# Altium project SparkyTime Project.PrjPcb
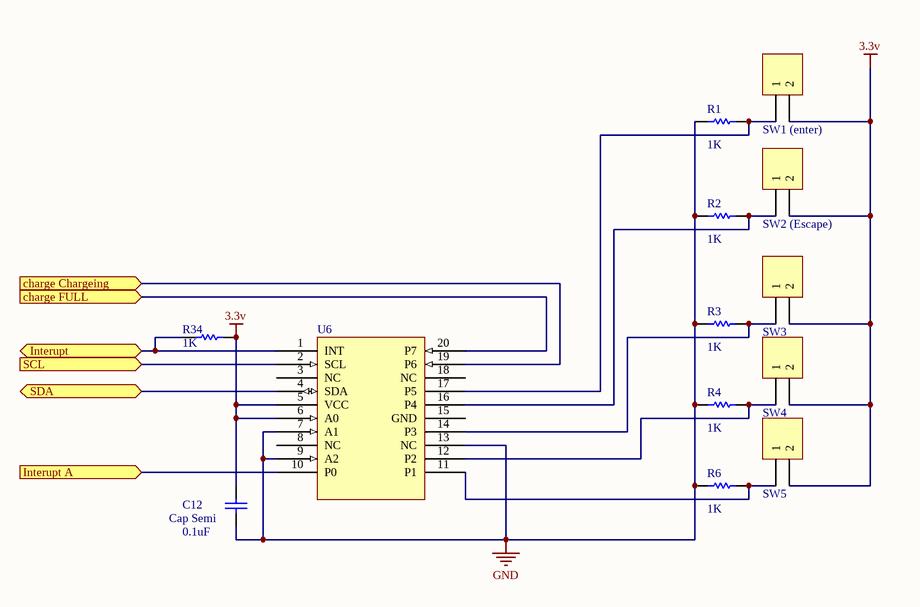
[diagram p0: Buttonz.SchDoc]
8 sheets, 94 parts. Net scope: flat (ports and power ports of the same name join across sheets).
Board files: SPARKy watch PCB MK1.PcbDoc, SPARKy watch PCB blank.PcbDoc, SPARKy watch PCB blank - David.PcbDoc
Sheets:
  Buttonz.SchDoc
  Serial devises.SchDoc
  Battery Sensor.SchDoc
  Screens.SchDoc
  MCU.SchDoc
  RTC.SchDoc
  Prefreals.SchDoc
  V stuff.SchDoc

## Sheet Buttonz.SchDoc
size A4

### Parts
C12  Cap Semi  value 0.1uF  [C1206]
P40  SW1 (enter)  [HDR1X2]
P41  SW2 (Escape)  [HDR1X2]
P42  SW3  [HDR1X2]
P43  SW4  [HDR1X2]
P44  SW5  [HDR1X2]
R1  value 1K  [0402]  (hidden comment: Res1)
R2  value 1K  [0402]  (hidden comment: Res1)
R3  value 1K  [0402]  (hidden comment: Res1)
R4  value 1K  [0402]  (hidden comment: Res1)
R6  value 1K  [0402]  (hidden comment: Res1)
R34  value 1K  [0402]  (hidden comment: Res1)
U6  Component_1  [SOP20]  (value not drawn)

### Ports
charge Chargeing (in), charge FULL (in), Interupt (bidir), Interupt A (in), SCL (in), SDA (bidir)

### Nets
3.3v: C12.2 P40.2 P41.2 P42.2 P43.2 P44.2 R34.2 U6.5(VCC) U6.6(A0)
GND: C12.1 R1.1 R2.1 R3.1 R4.1 R6.1 U6.7(A1) U6.9(A2) U6.13(NC)
NetP40_1: P40.1 R1.2 U6.17(P5)
NetP41_1: P41.1 R2.2 U6.16(P4)
NetP42_1: P42.1 R3.2 U6.14(P3)
NetP43_1: P43.1 R4.2 U6.12(P2)
NetP44_1: P44.1 R6.2 U6.11(P1)
NetR21_2: U6.20(P7) ; port charge FULL
NetR26_2: U6.19(P6) ; port charge Chargeing
NetR34_1: R34.1 U6.1(INT) ; port Interupt
NetU1_27: U6.4(SDA) ; port SDA
NetU1_28: U6.2(SCL) ; port SCL
NetU2_12: U6.10(P0) ; port Interupt A

Not connected (* = marked no-connect by the designer): U6 3(NC) 8(NC) 15(GND) 18(NC)

### Library data of the parts
C12 = Cap Semi: Capacitor (Semiconductor SIM Model); Published: 8-Jun-2000; LatestRevisionDate: 29-May-2009; LatestRevisionNote: IPC-7351 Footprint Added.; PackageReference: C1206; Publisher: Altium Limited; PackageDescription: Chip Capacitor
P40-P44 = Header 2: Header, 2-Pin; LatestRevisionDate: 17-Jul-2002; LatestRevisionNote: Re-released for DXP Platform.; Publisher: Altium Limited
R1-R4 R6 R34 = Res1: Resistor; Published: 8-Jun-2000; LatestRevisionDate: 17-Jul-2002; LatestRevisionNote: Re-released for DXP Platform.; PackageReference: AXIAL-0.3; Publisher: Altium Limited; PackageDescription: Axial Device, Thru-Hole; 2 Leads; 0.3 in Pin Spacing

## Sheet Serial devises.SchDoc
size A4
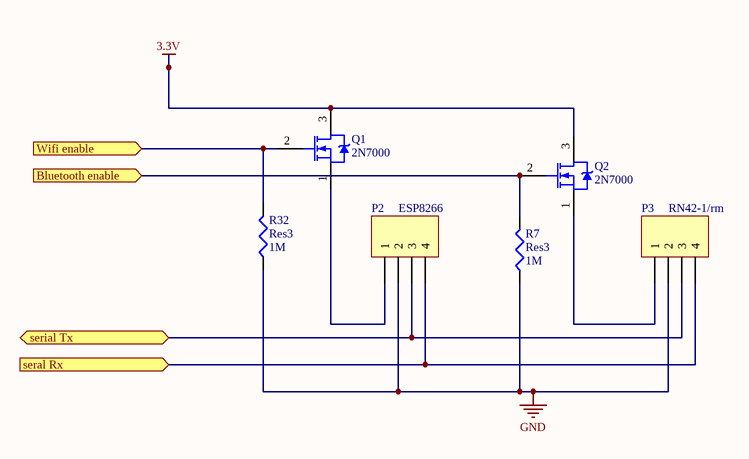
[diagram p1: Serial devises.SchDoc]

### Parts
P2  ESP8266  [HDR1X4]
P3  RN42-1/rm  [HDR1X4]
Q1  2N7000  [ONSC-SOT-323-3-419-04_V]
Q2  2N7000  [ONSC-SOT-323-3-419-04_V]
R7  Res3  value 1M  [0402]
R32  Res3  value 1M  [0402]

### Ports
Bluetooth enable (in), seral Rx (in), serial Tx (bidir), Wifi enable (in)

### Nets
3.3v: Q1.3(D) Q2.3(D)
GND: P2.2 P3.2 R7.1 R32.1
NetP1_2: P2.3 P3.3 ; port serial Tx
NetP1_3: P2.4 P3.4 ; port seral Rx
NetP2_1: P2.1 Q1.1(S)
NetP3_1: P3.1 Q2.1(S)
NetQ1_2: Q1.2(G) R32.2 ; port Wifi enable
NetQ2_2: Q2.2(G) R7.2 ; port Bluetooth enable

### Library data of the parts
P2 P3 = Header 4: Header, 4-Pin; LatestRevisionDate: 17-Jul-2002; LatestRevisionNote: Re-released for DXP Platform.; Publisher: Altium Limited
Q1 Q2 = 2N7000: Small Signal MOSFET, 200 mA, 60 V, N-Channel, 3-Pin TO-92, Bulk Box; Manufacturer: On Semiconductor; Channel Polarity: N Channel; Ciss Typ (pF): 60; Configuration: Single; Coss Typ (pF): 25; Crss Typ (pF): 5; ID Max (A): 0.2; PD Max (W): 0.35; VGS Max (V): 20; VGS(th) Max (V): 3; DatasheetVersion: Rev. 8; PackageVersion: Rev. AM; PackageReference: TO-92-3-29-11_AM_SL; PackageDescription: 3-Pin Transistor Outline, Body 4.825 x 3.685 mm, Pitch 1.27 mm; Package Type: TO-92; Packing: Bulk Box; V(BR)DSS Min (V): 60; Mounting Technology: Through Hole; PartNumber: 2N7000; ComponentLink1Description: Manufacturer URL; ComponentLink1URL: http://www.onsemi.com/; ComponentLink2Description: Datasheet; ComponentLink2URL: http://www.onsemi.com/pub_link/Collateral/2N7000-D.PDF; ComponentLink3Description: Package Specification; ComponentLink3URL: http://www.onsemi.cn/pub_link/Collateral/2N6426-D.PDF
R7 R32 = Res3: Resistor; Published: 8-Jun-2000; LatestRevisionDate: 29-May-2009; LatestRevisionNote: IPC-7351 Footprint Added.; PackageReference: J1-0603; Publisher: Altium Limited; PackageDescription: Chip Resistor

## Sheet Battery Sensor.SchDoc
size A4
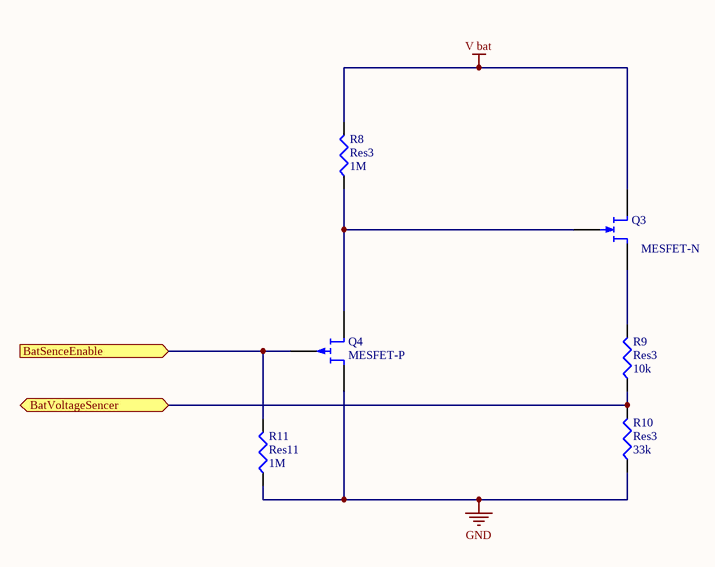
[diagram p2: Battery Sensor.SchDoc]

### Parts
Q3  MESFET-N  [ONSC-SOT-323-3-419-04_V]
Q4  MESFET-P  [ONSC-SOT-323-3-419-04_V]
R8  Res3  value 1M  [0402]
R9  Res3  value 10k  [0402]
R10  Res3  value 33k  [0402]
R11  Res11  value 1M  [0402]

### Ports
BatSenceEnable (in), BatVoltageSencer (bidir)

### Nets
GND: Q4.1(D) R10.1 R11.1
V bat: Q3.1(D) R8.2
NetQ3_2: Q3.2(G) Q4.3(S) R8.1
NetQ3_3: Q3.3(S) R9.2
NetQ4_2: Q4.2(G) R11.2 ; port BatSenceEnable
NetR9_1: R9.1 R10.2 ; port BatVoltageSencer

### Library data of the parts
Q3 = MESFET-N: N-Channel MESFET; Published: 8-Jun-2000; LatestRevisionDate: 17-Jul-2002; LatestRevisionNote: Re-released for DXP Platform.; PackageReference: TO-18; Publisher: Altium Limited; PackageDescription: Can; 3 Leads; Pin Circle Dia. 2.54 mm; Lead Dia. 0.48 mm (max); Code_JEDEC: TO-18
Q4 = MESFET-P: P-Channel MESFET; Published: 8-Jun-2000; LatestRevisionDate: 17-Jul-2002; LatestRevisionNote: Re-released for DXP Platform.; PackageReference: TO-18; Publisher: Altium Limited; PackageDescription: Can; 3 Leads; Pin Circle Dia. 2.54 mm; Lead Dia. 0.48 mm (max); Code_JEDEC: TO-18
R8-R11 = Res3: Resistor; Published: 8-Jun-2000; LatestRevisionDate: 29-May-2009; LatestRevisionNote: IPC-7351 Footprint Added.; PackageReference: J1-0603; Publisher: Altium Limited; PackageDescription: Chip Resistor

## Sheet Screens.SchDoc
size A4
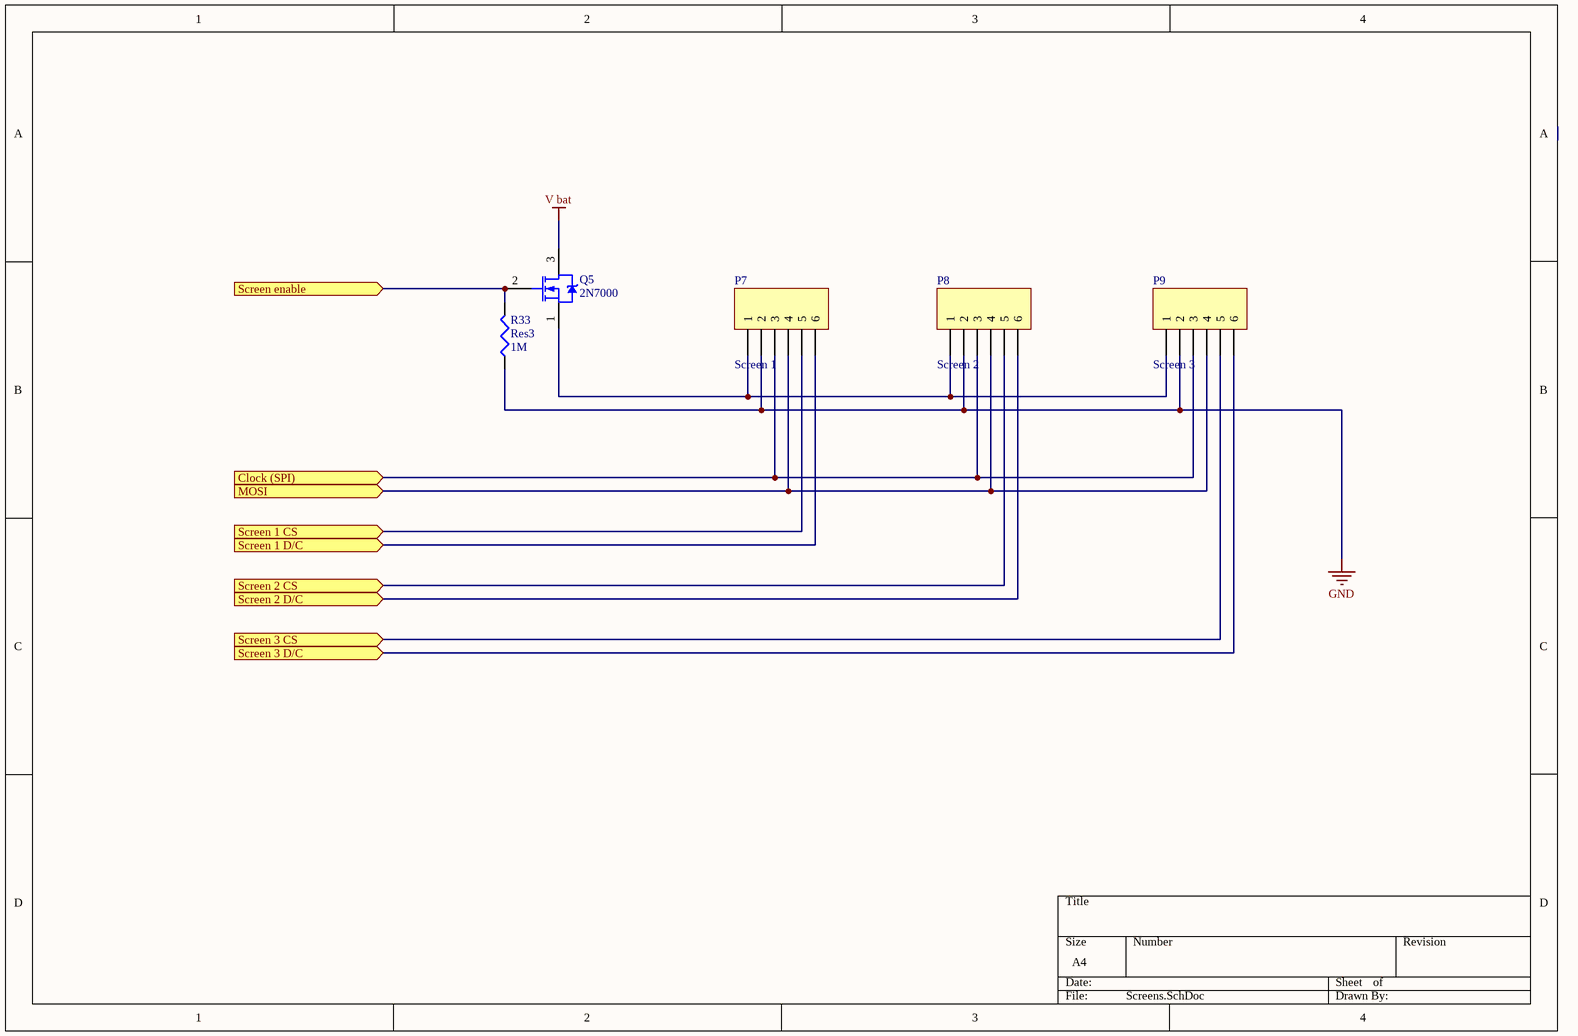
[diagram p3: Screens.SchDoc]

### Parts
P7  Screen 1  [HDR1X6]
P8  Screen 2  [HDR1X6]
P9  Screen 3  [HDR1X6]
Q5  2N7000  [ONSC-SOT-323-3-419-04_V]
R33  Res3  value 1M  [0402]

### Ports
Clock (SPI) (in), MOSI (in), Screen 1 CS (in), Screen 1 D/C (in), Screen 2 CS (in), Screen 2 D/C (in), Screen 3 CS (in), Screen 3 D/C (in), Screen enable (in)

### Nets
GND: P7.2 P8.2 P9.2 R33.1
V bat: Q5.3(D)
NetP7_1: P7.1 P8.1 P9.1 Q5.1(S)
NetP7_3: P7.3 P8.3 P9.3 ; port Clock (SPI)
NetP7_4: P7.4 P8.4 P9.4 ; port MOSI
NetP7_5: P7.5 ; port Screen 1 CS
NetP7_6: P7.6 ; port Screen 1 D/C
NetP8_5: P8.5 ; port Screen 2 CS
NetP8_6: P8.6 ; port Screen 2 D/C
NetP9_5: P9.5 ; port Screen 3 CS
NetP9_6: P9.6 ; port Screen 3 D/C
NetQ5_2: Q5.2(G) R33.2 ; port Screen enable

### Library data of the parts
P7-P9 = Header 6: Header, 6-Pin; LatestRevisionDate: 17-Jul-2002; LatestRevisionNote: Re-released for DXP Platform.; Publisher: Altium Limited
Q5 = 2N7000: as Q1 on sheet Serial devises; DatasheetVersion: Rev. 8; PackageVersion: Rev. AM; PackageReference: TO-92-3-29-11_AM_SL; PackageDescription: 3-Pin Transistor Outline, Body 4.825 x 3.685 mm, Pitch 1.27 mm; Package Type: TO-92; Packing: Bulk Box; V(BR)DSS Min (V): 60; Mounting Technology: Through Hole; PartNumber: 2N7000; ComponentLink1Description: Manufacturer URL; ComponentLink1URL: http://www.onsemi.com/; ComponentLink2Description: Datasheet; ComponentLink2URL: http://www.onsemi.com/pub_link/Collateral/2N7000-D.PDF; ComponentLink3Description: Package Specification; ComponentLink3URL: http://www.onsemi.cn/pub_link/Collateral/2N6426-D.PDF
R33 = Res3: Resistor; Published: 8-Jun-2000; LatestRevisionDate: 29-May-2009; LatestRevisionNote: IPC-7351 Footprint Added.; PackageReference: J1-0603; Publisher: Altium Limited; PackageDescription: Chip Resistor

## Sheet MCU.SchDoc
size A4
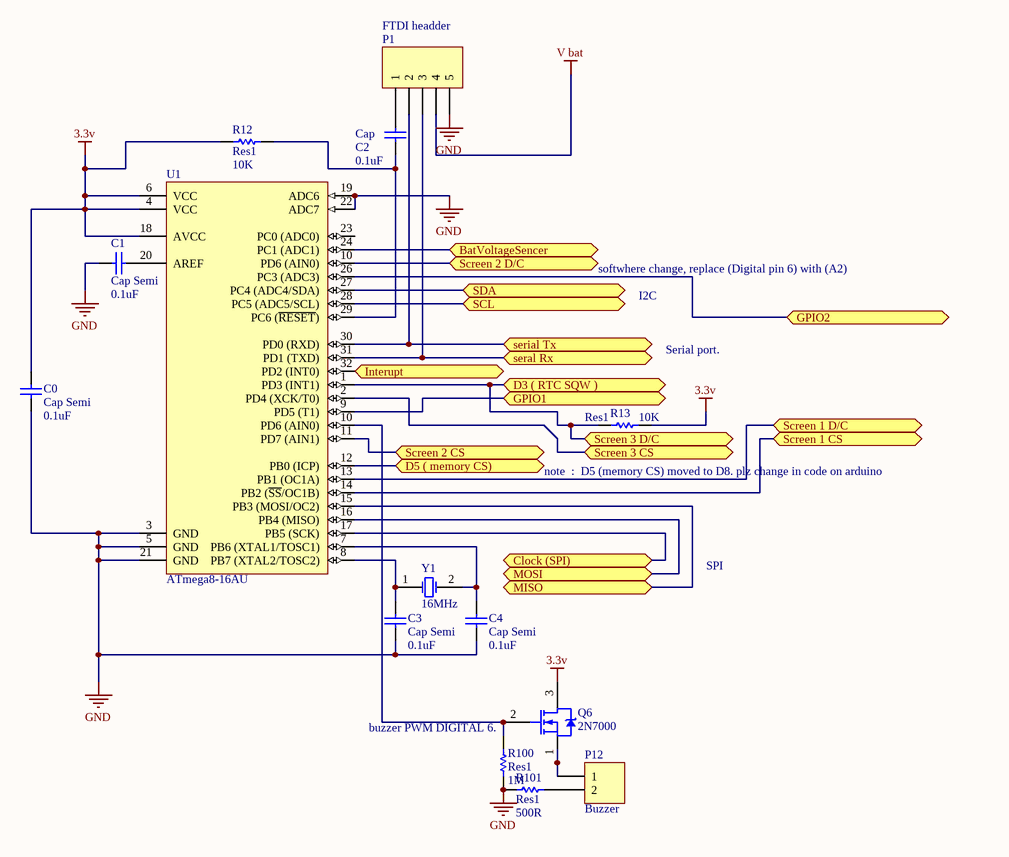
[diagram p4: MCU.SchDoc]

### Parts
(Parts that share a designator on the sheet are numbered #1, #2 ... from top to bottom, then left to right.)
C0  Cap Semi  value 0.1uF  [C1206]
C1  Cap Semi  value 0.1uF  [C1206]
C2  Cap  value 0.1uF  [J1-0603]
C3  Cap Semi  value 0.1uF  [C1206]
C4  Cap Semi  value 0.1uF  [C1206]
P1  FTDI headder  [HDR1X5]
P12#1  Buzzer  [HDR1X2]
Q6#1  2N7000  [ONSC-SOT-323-3-419-04_V]
R12  Res1  value 10K  [0402]
R13  Res1  value 10K  [0402]
R100  Res1  value 1M  [0603]
R101  Res1  value 500R  [0603]
U1  ATmega8-16AU  [32A_N]
Y1  16MHz  [R38]

### Ports
BatVoltageSencer (bidir), Clock (SPI) (bidir), D3 ( RTC SQW ) (bidir), D5 ( memory CS) (bidir), GPIO1 (bidir), GPIO2 (bidir), Interupt (bidir), MISO (bidir), MOSI (bidir), SCL (bidir), Screen 1 CS (bidir), Screen 1 D/C (bidir), Screen 2 CS (bidir), Screen 2 D/C (bidir), Screen 3 CS (bidir), Screen 3 D/C (bidir), SDA (bidir), seral Rx (bidir), serial Tx (bidir)

### Nets
3.3v: C0.2 Q6#1.3(D) R12.1 R13.2 U1.4(VCC) U1.6(VCC) U1.18(AVCC)
GND: C0.1 C1.1 C3.1 C4.1 P1.5 R100.2 R101.1 U1.3(GND) U1.5(GND) U1.19(ADC6) U1.21(GND) U1.22(ADC7)
V bat: P1.4
NetC1_2: C1.2 U1.20(AREF)
NetC2_1: C2.1 P1.1
NetC2_2: C2.2 R12.2 U1.29(PC6_(~{RESET}))
NetC3_2: C3.2 U1.8(PB7_(XTAL2/TOSC2)) Y1.1(OSC1)
NetC4_2: C4.2 U1.7(PB6_(XTAL1/TOSC1)) Y1.2(OSC2)
NetD2_1: U1.9(PD5_(T1)) ; port GPIO1
NetD4_1: U1.26(PC3_(ADC3)) ; port GPIO2
NetP1_2: P1.2 U1.30(PD0_(RXD)) ; port serial Tx
NetP1_3: P1.3 U1.31(PD1_(TXD)) ; port seral Rx
NetP7_3: U1.17(PB5_(SCK)) ; port Clock (SPI)
NetP7_4: U1.16(PB4_(MISO)) ; port MOSI
NetP7_5: U1.14(PB2_(~{SS}/OC1B)) ; port Screen 1 CS
NetP7_6: U1.13(PB1_(OC1A)) ; port Screen 1 D/C
NetP8_5: U1.11(PD7_(AIN1)) ; port Screen 2 CS
NetP8_6: U1.10(PD6_(AIN0)) ; port Screen 2 D/C
NetP9_5: U1.2(PD4_(XCK/T0)) ; port Screen 3 CS
NetP9_6: R13.1 U1.1(PD3_(INT1)) ; port Screen 3 D/C, port D3 ( RTC SQW )
NetP12#1_1: P12#1.1 Q6#1.1(S)
NetP12#1_2: P12#1.2 R101.2
NetQ6#1_2: Q6#1.2(G) R100.1 U1.10(PD6_(AIN0))
NetR9_1: U1.24(PC1_(ADC1)) ; port BatVoltageSencer
NetR34_1: U1.32(PD2_(INT0)) ; port Interupt
NetU1_12: U1.12(PB0_(ICP)) ; port D5 ( memory CS)
NetU1_15: U1.15(PB3_(MOSI/OC2)) ; port MISO
NetU1_27: U1.27(PC4_(ADC4/SDA)) ; port SDA
NetU1_28: U1.28(PC5_(ADC5/SCL)) ; port SCL

Not connected (* = marked no-connect by the designer): U1 23(PC0_(ADC0))

### Notes on the sheet
- softwhere change, replace (Digital pin 6) with (A2)
- I2C
- Serial port.
- (near R13) note  :  D5 (memory CS) moved to D8. plz change in code on arduino
- SPI
- (near R100) buzzer PWM DIGITAL 6.

### Library data of the parts
C0 C1 C3 C4 = Cap Semi: Capacitor (Semiconductor SIM Model); Published: 8-Jun-2000; LatestRevisionDate: 29-May-2009; LatestRevisionNote: IPC-7351 Footprint Added.; PackageReference: C1206; Publisher: Altium Limited; PackageDescription: Chip Capacitor
C2 = Cap: Capacitor; Published: 8-Jun-2000; LatestRevisionDate: 17-Jul-2002; LatestRevisionNote: Re-released for DXP Platform.; PackageReference: RAD-0.3; Publisher: Altium Limited; PackageDescription: Radial Cap, Thru-Hole; 2 Leads; 0.3 in Pin Spacing
P1 = Header 5: Header, 5-Pin; LatestRevisionDate: 17-Jul-2002; LatestRevisionNote: Re-released for DXP Platform.; Publisher: Altium Limited
P12#1 = Header 2: Header, 2-Pin; LatestRevisionDate: 17-Jul-2002; LatestRevisionNote: Re-released for DXP Platform.; Publisher: Altium Limited
Q6#1 = 2N7000: as Q1 on sheet Serial devises; DatasheetVersion: Rev. 8; PackageVersion: Rev. AM; PackageReference: TO-92-3-29-11_AM_SL; PackageDescription: 3-Pin Transistor Outline, Body 4.825 x 3.685 mm, Pitch 1.27 mm; Package Type: TO-92; Packing: Bulk Box; V(BR)DSS Min (V): 60; Mounting Technology: Through Hole; PartNumber: 2N7000; ComponentLink1Description: Manufacturer URL; ComponentLink1URL: http://www.onsemi.com/; ComponentLink2Description: Datasheet; ComponentLink2URL: http://www.onsemi.com/pub_link/Collateral/2N7000-D.PDF; ComponentLink3Description: Package Specification; ComponentLink3URL: http://www.onsemi.cn/pub_link/Collateral/2N6426-D.PDF
R12 R13 R100 R101 = Res1: Resistor; Published: 8-Jun-2000; LatestRevisionDate: 17-Jul-2002; LatestRevisionNote: Re-released for DXP Platform.; PackageReference: AXIAL-0.3; Publisher: Altium Limited; PackageDescription: Axial Device, Thru-Hole; 2 Leads; 0.3 in Pin Spacing
U1 = ATmega8-16AU: 8-bit AVR Microcontroller, 4.5-5.5V, 16MHz, 8KB Flash, 512 Bytes EEPROM, 1KB SRAM, 32-pin TQFP, Industrial Grade (-40°C to 85°C); DatasheetVersion: revZ, Feb-2011; PackageVersion: revC, Oct-2010; PackageReference: 32A; PackageDescription: 32-Lead, 7x7x1.0 mm Body, 0.8mm Lead Pitch, Thin Profile Plastic Quad Flat Package (TQFP); Code_JEDEC: MS-026-ABA; ComponentLink1Description: Manufacturer URL; ComponentLink1URL: http://www.atmel.com/; ComponentLink2Description: ATmega8(L); ComponentLink2URL: http://www.atmel.com/dyn/resources/prod_documents/doc2486.pdf; ComponentLink3Description: ATmega8(L) Summary; ComponentLink3URL: http://www.atmel.com/dyn/resources/prod_documents/2486S.pdf
Y1 = XTAL: Crystal Oscillator; Published: 8-Jun-2000; LatestRevisionDate: 17-Jul-2002; LatestRevisionNote: Re-released for DXP Platform.; PackageReference: R38; Publisher: Altium Limited; PackageDescription: Crystal, Thru-Hole; 2 Leads; Body 3.1 x 8.2 mm (Dia.xH)

## Sheet RTC.SchDoc
size A4
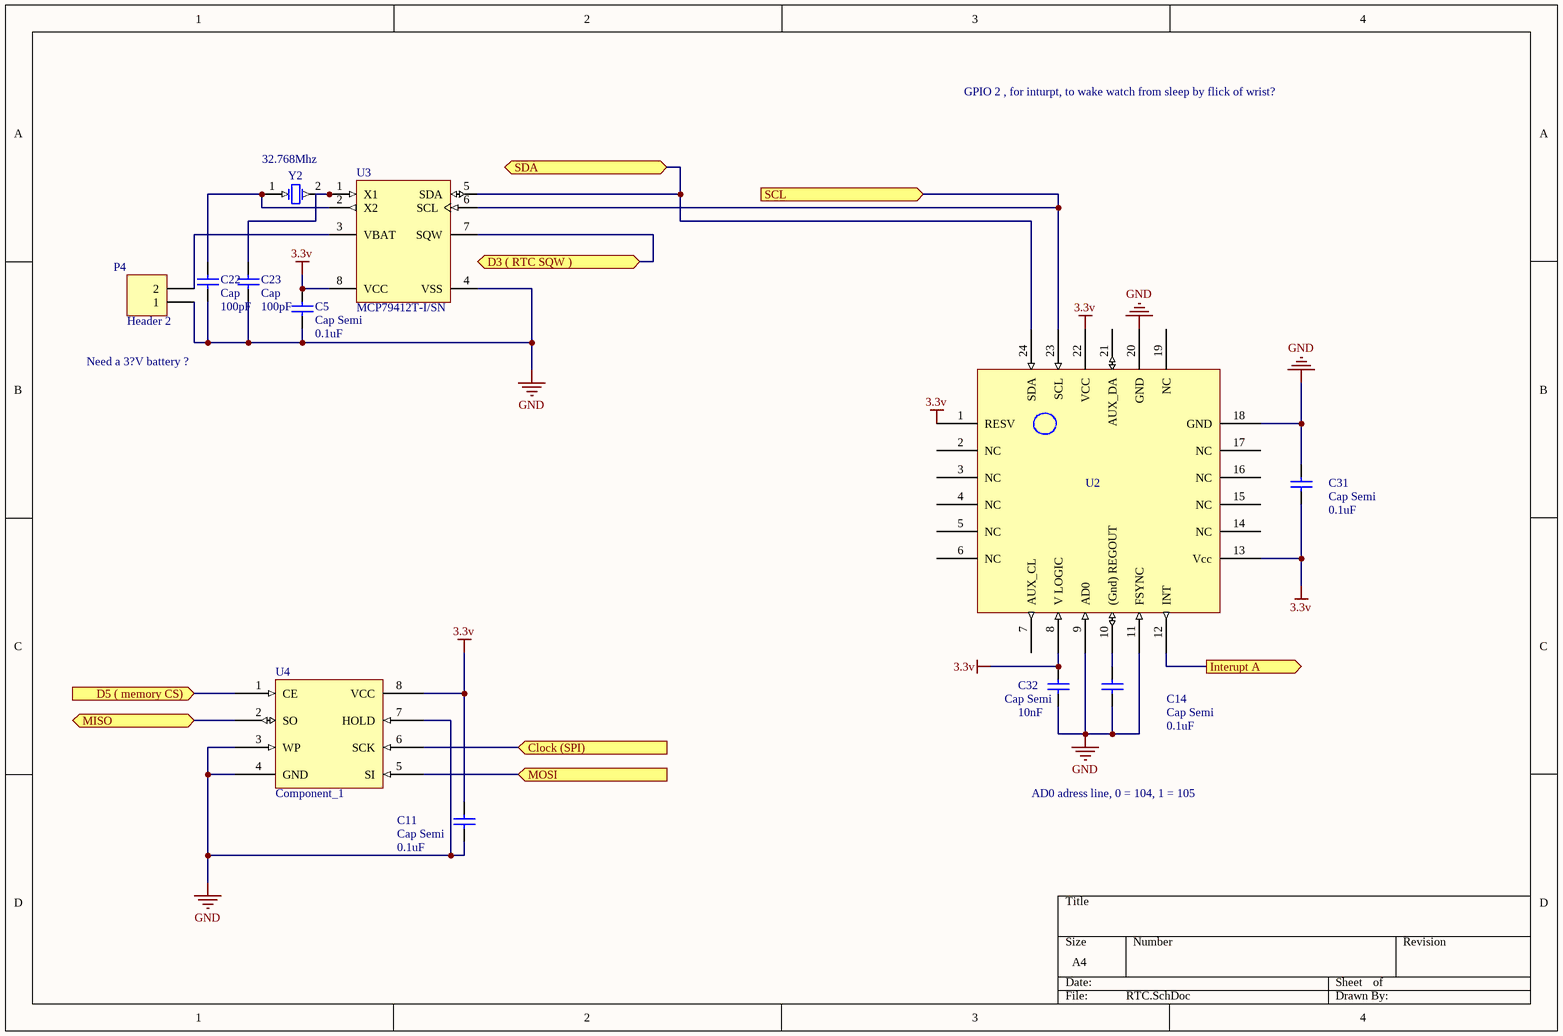
[diagram p5: RTC.SchDoc]

### Parts
C5  Cap Semi  value 0.1uF  [C1206]
C11  Cap Semi  value 0.1uF  [C1206]
C14  Cap Semi  value 0.1uF  [C1206]
C22  Cap  value 100pF  [C1206]
C23  Cap  value 100pF  [C1206]
C31  Cap Semi  value 0.1uF  [C1206]
C32  Cap Semi  value 10nF  [C1206]
P4  Header 2  [HDR1X2]
U2  Component_1  [MPU-9255]  (value not drawn)
U3  MCP79412T-I/SN  [SOIC-SN8_N]
U4  Component_1  [SOP8]
Y2  32.768Mhz  [R38]

### Ports
Clock (SPI) (in), D3 ( RTC SQW ) (bidir), D5 ( memory CS) (in), Interupt A (out), MISO (bidir), MOSI (in), SCL (in), SDA (bidir)

### Nets
3.3v: C5.2 C11.2 C31.1 C32.2 U2.1(RESV) U2.8(V_LOGIC) U2.13(Vcc) U2.22(VCC) U3.8(VCC) U4.8(VCC)
GND: C5.1 C11.1 C14.1 C22.1 C23.1 C31.2 C32.1 P4.1 U2.9(AD0) U2.11(FSYNC) U2.18(GND) U2.20(GND) U3.4(VSS) U4.3(WP) U4.4(GND) U4.7(HOLD)
NetC14_2: C14.2 U2.10((Gnd)_REGOUT)
NetC22_2: C22.2 U3.2(X2) Y2.1(OSC1)
NetC23_2: C23.2 U3.1(X1) Y2.2(OSC2)
NetP4_2: P4.2 U3.3(VBAT)
NetP7_3: U4.6(SCK) ; port Clock (SPI)
NetP7_4: U4.5(SI) ; port MOSI
NetP9_6: U3.7(SQW) ; port D3 ( RTC SQW )
NetU1_12: U4.1(CE) ; port D5 ( memory CS)
NetU1_15: U4.2(SO) ; port MISO
NetU1_27: U2.24(SDA) U3.5(SDA) ; port SDA
NetU1_28: U2.23(SCL) U3.6(SCL) ; port SCL
NetU2_12: U2.12(INT) ; port Interupt A

Not connected (* = marked no-connect by the designer): U2 2(NC) 3(NC) 4(NC) 5(NC) 6(NC) 7(AUX_CL) 14(NC) 15(NC) 16(NC) 17(NC) 19(NC) 21(AUX_DA)

### Notes on the sheet
- GPIO 2 , for inturpt, to wake watch from sleep by flick of wrist?
- Need a 3?V battery ?
- AD0 adress line, 0 = 104, 1 = 105

### Library data of the parts
C5 C11 C14 C31 C32 = Cap Semi: Capacitor (Semiconductor SIM Model); Published: 8-Jun-2000; LatestRevisionDate: 29-May-2009; LatestRevisionNote: IPC-7351 Footprint Added.; PackageReference: C1206; Publisher: Altium Limited; PackageDescription: Chip Capacitor
C22 C23 = Cap: Capacitor; Published: 8-Jun-2000; LatestRevisionDate: 17-Jul-2002; LatestRevisionNote: Re-released for DXP Platform.; PackageReference: RAD-0.3; Publisher: Altium Limited; PackageDescription: Radial Cap, Thru-Hole; 2 Leads; 0.3 in Pin Spacing
P4 = Header 2: Header, 2-Pin; LatestRevisionDate: 17-Jul-2002; LatestRevisionNote: Re-released for DXP Platform.; Publisher: Altium Limited
U3 = MCP79412T-I/SN: I2C Real-Time Clock/Calendar with EEPROM, SRAM, Unique ID and Battery Switchover, 8-Pin SOIC, Industrial Temperature, Tape and Reel; Manufacturer: Microchip; DatasheetVersion: revD, Dec-2011; PackageVersion: revBB, Aug-2009; PackageReference: SOIC-SN8; PackageDescription: 8-Lead Plastic Small Outline (SN) - Narrow, 3.90mm Body [SOIC]; Supplier 1: Digi-Key; Supplier Part Number 1: MCP79412T-I/SN-ND; Supplier 2: Mouser; Supplier Part Number 2: 579-MCP79412TISN; Mounting Technology: Surface Mount; PartNumber: MCP79412T-I/SN; ComponentLink1Description: Manufacturer URL; ComponentLink1URL: http://www.microchip.com/; ComponentLink2Description: Datasheet; ComponentLink2URL: http://ww1.microchip.com/downloads/en/DeviceDoc/22266D.pdf; ComponentLink3Description: Package Specification; ComponentLink3URL: http://www.microchip.com/stellent/groups/techpub_sg/documents/packagingspec/en012702.pdf; Code_JEDEC: MS-012; Code_IPC: SOIC127P600-8
Y2 = XTAL: Crystal Oscillator; Published: 8-Jun-2000; LatestRevisionDate: 17-Jul-2002; LatestRevisionNote: Re-released for DXP Platform.; PackageReference: R38; Publisher: Altium Limited; PackageDescription: Crystal, Thru-Hole; 2 Leads; Body 3.1 x 8.2 mm (Dia.xH)

## Sheet Prefreals.SchDoc
size A4
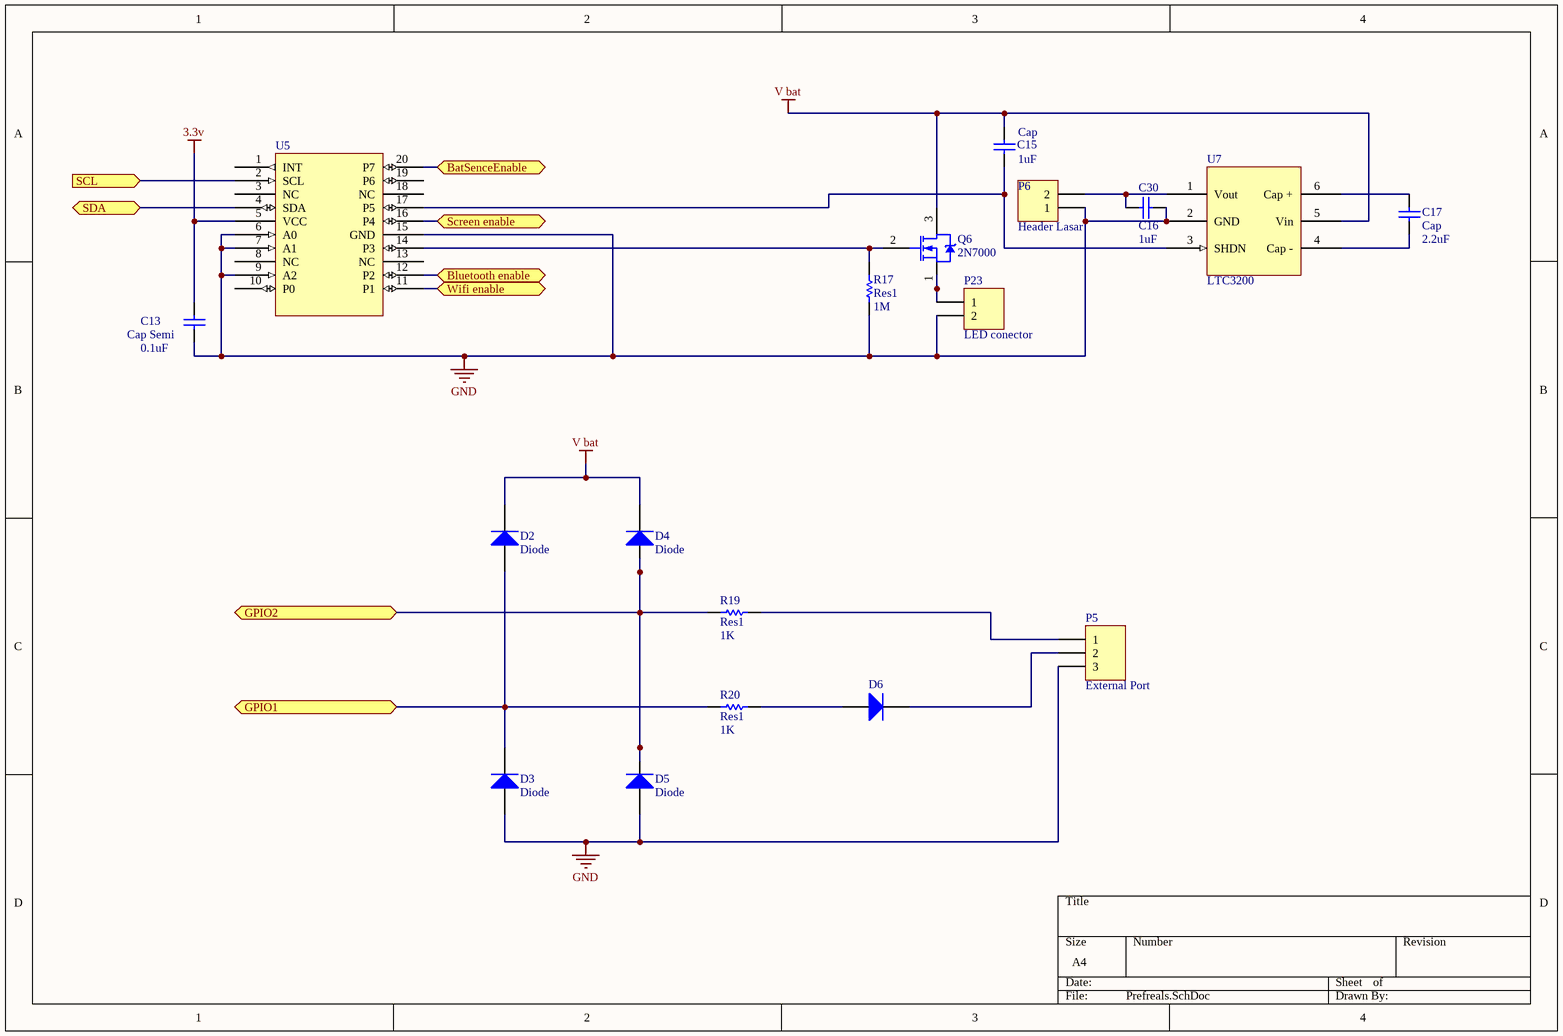
[diagram p6: Prefreals.SchDoc]

### Parts
(Parts that share a designator on the sheet are numbered #1, #2 ... from top to bottom, then left to right.)
C13  Cap Semi  value 0.1uF  [C1206]
C15  Cap  value 1uF  [J1-0603]
C17  Cap  value 2.2uF  [J1-0603]
C30  C16  value 1uF  [J1-0603]
D2  Diode  [J1-0603]
D3  Diode  [J1-0603]
D4  Diode  [J1-0603]
D5  Diode  [J1-0603]
D6  de ??  [J1-0603]  (value not drawn)
P5  External Port  [HDR1X3]
P6  Header Lasar  [HDR1X2]
P23  LED conector  [HDR1X2]
Q6#2  2N7000  [ONSC-SOT-323-3-419-04_V]
R17  Res1  value 1M  [0402]
R19  Res1  value 1K  [0402]
R20  Res1  value 1K  [0402]
U5  Component_1  [SOP20]  (value not drawn)
U7  LTC3200  [SOP6]

### Ports
BatSenceEnable (bidir), Bluetooth enable (bidir), GPIO1 (bidir), GPIO2 (bidir), SCL (in), Screen enable (bidir), SDA (bidir), Wifi enable (bidir)

### Nets
3.3v: C13.2 U5.5(VCC)
GND: C13.1 C30.2 D3.1(A) D5.1(A) P5.3 P6.1 P23.2 R17.1 U5.6(A0) U5.7(A1) U5.9(A2) U5.15(GND) U7.2(GND)
V bat: C15.2 D2.2(K) D4.2(K) Q6#2.3(D) U7.5(Vin)
NetC15_1: C15.1 U5.17(P5) U7.3(SHDN)
NetC17_1: C17.1 U7.4(Cap_-)
NetC17_2: C17.2 U7.6(Cap_+)
NetC30_1: C30.1 P6.2 U7.1(Vout)
NetD2_1: D2.1(A) D3.2(K) R20.1 ; port GPIO1
NetD4_1: D4.1(A) D5.2(K) R19.1 ; port GPIO2
NetD6_1: D6.1(A) R20.2
NetD6_2: D6.2(K) P5.2
NetP5_1: P5.1 R19.2
NetP23_1: P23.1 Q6#2.1(S)
NetQ1_2: U5.11(P1) ; port Wifi enable
NetQ2_2: U5.12(P2) ; port Bluetooth enable
NetQ4_2: U5.20(P7) ; port BatSenceEnable
NetQ5_2: U5.16(P4) ; port Screen enable
NetQ6#2_2: Q6#2.2(G) R17.2 U5.14(P3)
NetU1_27: U5.4(SDA) ; port SDA
NetU1_28: U5.2(SCL) ; port SCL

Not connected (* = marked no-connect by the designer): U5 1(INT) 3(NC) 8(NC) 10(P0) 13(NC) 18(NC) 19(P6)

### Library data of the parts
C13 = Cap Semi: Capacitor (Semiconductor SIM Model); Published: 8-Jun-2000; LatestRevisionDate: 29-May-2009; LatestRevisionNote: IPC-7351 Footprint Added.; PackageReference: C1206; Publisher: Altium Limited; PackageDescription: Chip Capacitor
C15 C17 C30 = Cap: Capacitor; Published: 8-Jun-2000; LatestRevisionDate: 17-Jul-2002; LatestRevisionNote: Re-released for DXP Platform.; PackageReference: RAD-0.3; Publisher: Altium Limited; PackageDescription: Radial Cap, Thru-Hole; 2 Leads; 0.3 in Pin Spacing
D2-D6 = Diode: Default Diode; Published: 8-Jun-2000; LatestRevisionDate: 17-Jul-2002; LatestRevisionNote: Re-released for DXP Platform.; PackageVersion: Sep-1996; PackageReference: SMC; Publisher: Altium Limited; PackageDescription: DO-214-AB/SMC; 2 C-Bend Leads; Body 7.9 x 5.9 mm, inc. leads (LxW); Code_JEDEC: DO-214-AB
P5 = Header 3: Header, 3-Pin; LatestRevisionDate: 17-Jul-2002; LatestRevisionNote: Re-released for DXP Platform.; Publisher: Altium Limited
P6 P23 = Header 2: Header, 2-Pin; LatestRevisionDate: 17-Jul-2002; LatestRevisionNote: Re-released for DXP Platform.; Publisher: Altium Limited
Q6#2 = 2N7000: as Q1 on sheet Serial devises; DatasheetVersion: Rev. 8; PackageVersion: Rev. AM; PackageReference: TO-92-3-29-11_AM_SL; PackageDescription: 3-Pin Transistor Outline, Body 4.825 x 3.685 mm, Pitch 1.27 mm; Package Type: TO-92; Packing: Bulk Box; V(BR)DSS Min (V): 60; Mounting Technology: Through Hole; PartNumber: 2N7000; ComponentLink1Description: Manufacturer URL; ComponentLink1URL: http://www.onsemi.com/; ComponentLink2Description: Datasheet; ComponentLink2URL: http://www.onsemi.com/pub_link/Collateral/2N7000-D.PDF; ComponentLink3Description: Package Specification; ComponentLink3URL: http://www.onsemi.cn/pub_link/Collateral/2N6426-D.PDF
R17 R19 R20 = Res1: Resistor; Published: 8-Jun-2000; LatestRevisionDate: 17-Jul-2002; LatestRevisionNote: Re-released for DXP Platform.; PackageReference: AXIAL-0.3; Publisher: Altium Limited; PackageDescription: Axial Device, Thru-Hole; 2 Leads; 0.3 in Pin Spacing
U7 = Component_1

## Sheet V stuff.SchDoc
size A4
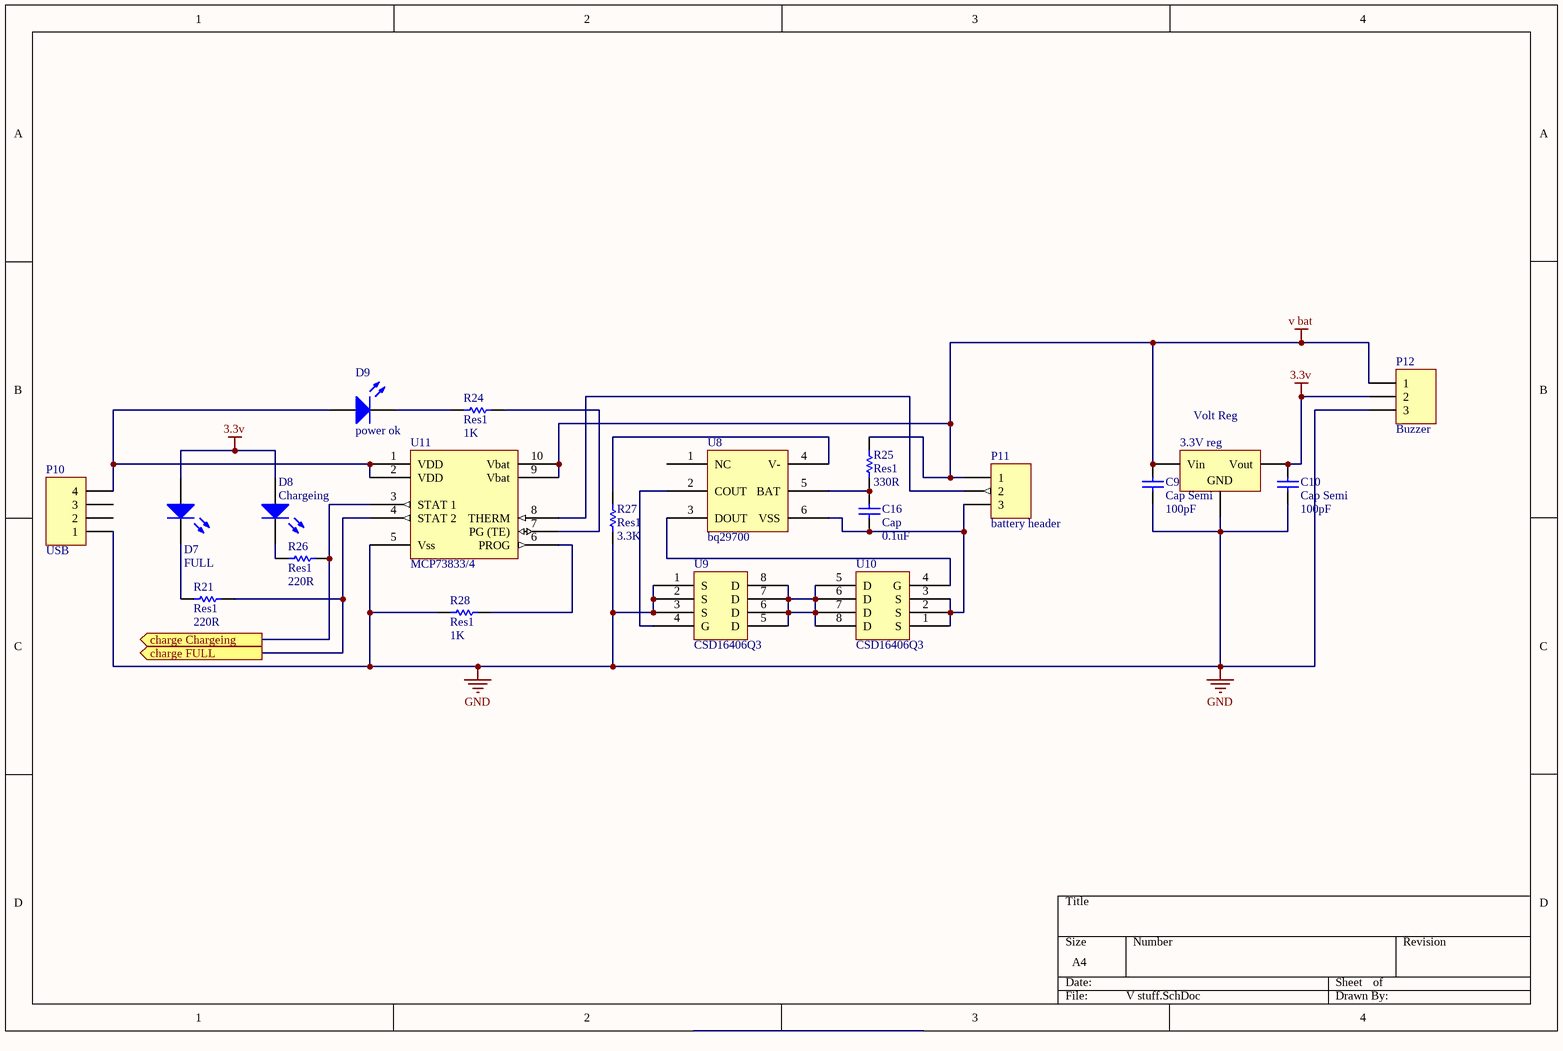
[diagram p7: V stuff.SchDoc]

### Parts
(Parts that share a designator on the sheet are numbered #1, #2 ... from top to bottom, then left to right.)
3.3V_reg  Volt Reg  [SOT23_M]
C9  Cap Semi  value 100pF  [C1206]
C10  Cap Semi  value 100pF  [C1206]
C16  Cap  value 0.1uF  [J1-0603]
D7  FULL  [J1-0603]
D8  Chargeing  [J1-0603]
D9  power ok  [J1-0603]
P10  USB  [HDR1X4]
P11  battery header  [HDR1X3]
P12#2  Buzzer  [HDR1X2]
R21  Res1  value 220R  [0402]
R24  Res1  value 1K  [0402]
R25  Res1  value 330R  [0402]
R26  Res1  value 220R  [0402]
R27  Res1  value 3.3K  [0402]
R28  Res1  value 1K  [0402]
U8  bq29700  [DSE]
U9  CSD16406Q3  [Q3]
U10  CSD16406Q3  [Q3]
U11  MCP73833/4  [SOP10]

### Ports
charge Chargeing (out), charge FULL (out)

### Nets
3.3v: 3.3V_reg.3(Vout) C10.2 D7.1(A) D8.1(A) P12#2.2
GND: 3.3V_reg.2(GND) C9.1 C10.1 P10.1 P12#2.3 R27.2 R28.1 U9.1(S) U9.2(S) U9.3(S) U11.5(Vss)
V bat: 3.3V_reg.1(Vin) C9.2 P11.1 P12#2.1 R25.1 U11.9(Vbat) U11.10(Vbat)
NetC16_1: C16.1 P11.3 U8.6(VSS) U10.1(S) U10.2(S) U10.3(S)
NetC16_2: C16.2 R25.2 U8.5(BAT)
NetD7_2: D7.2(K) R21.1
NetD8_2: D8.2(K) R26.1
NetD9_1: D9.1(A) P10.4 U11.1(VDD) U11.2(VDD)
NetD9_2: D9.2(K) R24.1
NetP11_2: P11.2 U11.8(THERM)
NetR21_2: R21.2 U11.4(STAT_2) ; port charge FULL
NetR24_2: R24.2 U11.7(PG_(TE))
NetR26_2: R26.2 U11.3(STAT_1) ; port charge Chargeing
NetR27_1: R27.1 U8.4(V-)
NetR28_2: R28.2 U11.6(PROG)
NetU8_2: U8.2(COUT) U9.4(G)
NetU8_3: U8.3(DOUT) U10.4(G)
NetU9_5: U9.5(D) U9.6(D) U9.7(D) U9.8(D) U10.5(D) U10.6(D) U10.7(D) U10.8(D)

Not connected (* = marked no-connect by the designer): P10 2 3; U8 1(NC)

### Library data of the parts
3.3V_reg = Volt Reg: Voltage Regulator; Published: 24-Mar-1999; LatestRevisionDate: 29-May-2009; LatestRevisionNote: IPC-7351 Footprint Added.; PackageReference: D2PAK; Publisher: Altium Limited; PackageDescription: 3-Pin Transistor Outline Package 2.54 mm Pitch, 15.1 mm Lead Span
C9 C10 = Cap Semi: Capacitor (Semiconductor SIM Model); Published: 8-Jun-2000; LatestRevisionDate: 29-May-2009; LatestRevisionNote: IPC-7351 Footprint Added.; PackageReference: C1206; Publisher: Altium Limited; PackageDescription: Chip Capacitor
C16 = Cap: Capacitor; Published: 8-Jun-2000; LatestRevisionDate: 17-Jul-2002; LatestRevisionNote: Re-released for DXP Platform.; PackageReference: RAD-0.3; Publisher: Altium Limited; PackageDescription: Radial Cap, Thru-Hole; 2 Leads; 0.3 in Pin Spacing
D7-D9 = LED1: Typical RED GaAs LED; Published: 8-Jun-2000; LatestRevisionDate: 08-Jul-2005; LatestRevisionNote: Mech Layer 1 removed.; PackageReference: LED-1; Publisher: Altium Limited; PackageDescription: LED; 2 Leads
P10 = Header 4: Header, 4-Pin; LatestRevisionDate: 17-Jul-2002; LatestRevisionNote: Re-released for DXP Platform.; Publisher: Altium Limited
P11 P12#2 = Header 3: Header, 3-Pin; LatestRevisionDate: 17-Jul-2002; LatestRevisionNote: Re-released for DXP Platform.; Publisher: Altium Limited
R21 R24-R28 = Res1: Resistor; Published: 8-Jun-2000; LatestRevisionDate: 17-Jul-2002; LatestRevisionNote: Re-released for DXP Platform.; PackageReference: AXIAL-0.3; Publisher: Altium Limited; PackageDescription: Axial Device, Thru-Hole; 2 Leads; 0.3 in Pin Spacing
U8-U11 = Component_1

## Nets that join several sheets
3.3v: Buttonz (9 pins), Serial devises (Q1.3 Q2.3), MCU (7 pins), RTC (10 pins), Prefreals (C13.2 U5.5), V stuff (5 pins)
GND: Buttonz (9 pins), Serial devises (P2.2 P3.2 R7.1 R32.1), Battery Sensor (Q4.1 R10.1 R11.1), Screens (P7.2 P8.2 P9.2 R33.1), MCU (12 pins), RTC (16 pins), Prefreals (13 pins), V stuff (11 pins)
V bat: Battery Sensor (Q3.1 R8.2), Screens (Q5.3), MCU (P1.4), Prefreals (5 pins), V stuff (7 pins)
NetD2_1: MCU (U1.9), Prefreals (D2.1 D3.2 R20.1)
NetD4_1: MCU (U1.26), Prefreals (D4.1 D5.2 R19.1)
NetP1_2: Serial devises (P2.3 P3.3), MCU (P1.2 U1.30)
NetP1_3: Serial devises (P2.4 P3.4), MCU (P1.3 U1.31)
NetP7_3: Screens (P7.3 P8.3 P9.3), MCU (U1.17), RTC (U4.6)
NetP7_4: Screens (P7.4 P8.4 P9.4), MCU (U1.16), RTC (U4.5)
NetP7_5: Screens (P7.5), MCU (U1.14)
NetP7_6: Screens (P7.6), MCU (U1.13)
NetP8_5: Screens (P8.5), MCU (U1.11)
NetP8_6: Screens (P8.6), MCU (U1.10)
NetP9_5: Screens (P9.5), MCU (U1.2)
NetP9_6: Screens (P9.6), MCU (R13.1 U1.1), RTC (U3.7)
NetQ1_2: Serial devises (Q1.2 R32.2), Prefreals (U5.11)
NetQ2_2: Serial devises (Q2.2 R7.2), Prefreals (U5.12)
NetQ4_2: Battery Sensor (Q4.2 R11.2), Prefreals (U5.20)
NetQ5_2: Screens (Q5.2 R33.2), Prefreals (U5.16)
NetR9_1: Battery Sensor (R9.1 R10.2), MCU (U1.24)
NetR21_2: Buttonz (U6.20), V stuff (R21.2 U11.4)
NetR26_2: Buttonz (U6.19), V stuff (R26.2 U11.3)
NetR34_1: Buttonz (R34.1 U6.1), MCU (U1.32)
NetU1_12: MCU (U1.12), RTC (U4.1)
NetU1_15: MCU (U1.15), RTC (U4.2)
NetU1_27: Buttonz (U6.4), MCU (U1.27), RTC (U2.24 U3.5), Prefreals (U5.4)
NetU1_28: Buttonz (U6.2), MCU (U1.28), RTC (U2.23 U3.6), Prefreals (U5.2)
NetU2_12: Buttonz (U6.10), RTC (U2.12)